# EasyEDA schematic Schematic.json
TITLE: Thiết kế hệ thống chống trộm sử dụng; REV: 1.0; Date: 2023-04-01; Sheet: 1/1; Company: CCE-SPKT
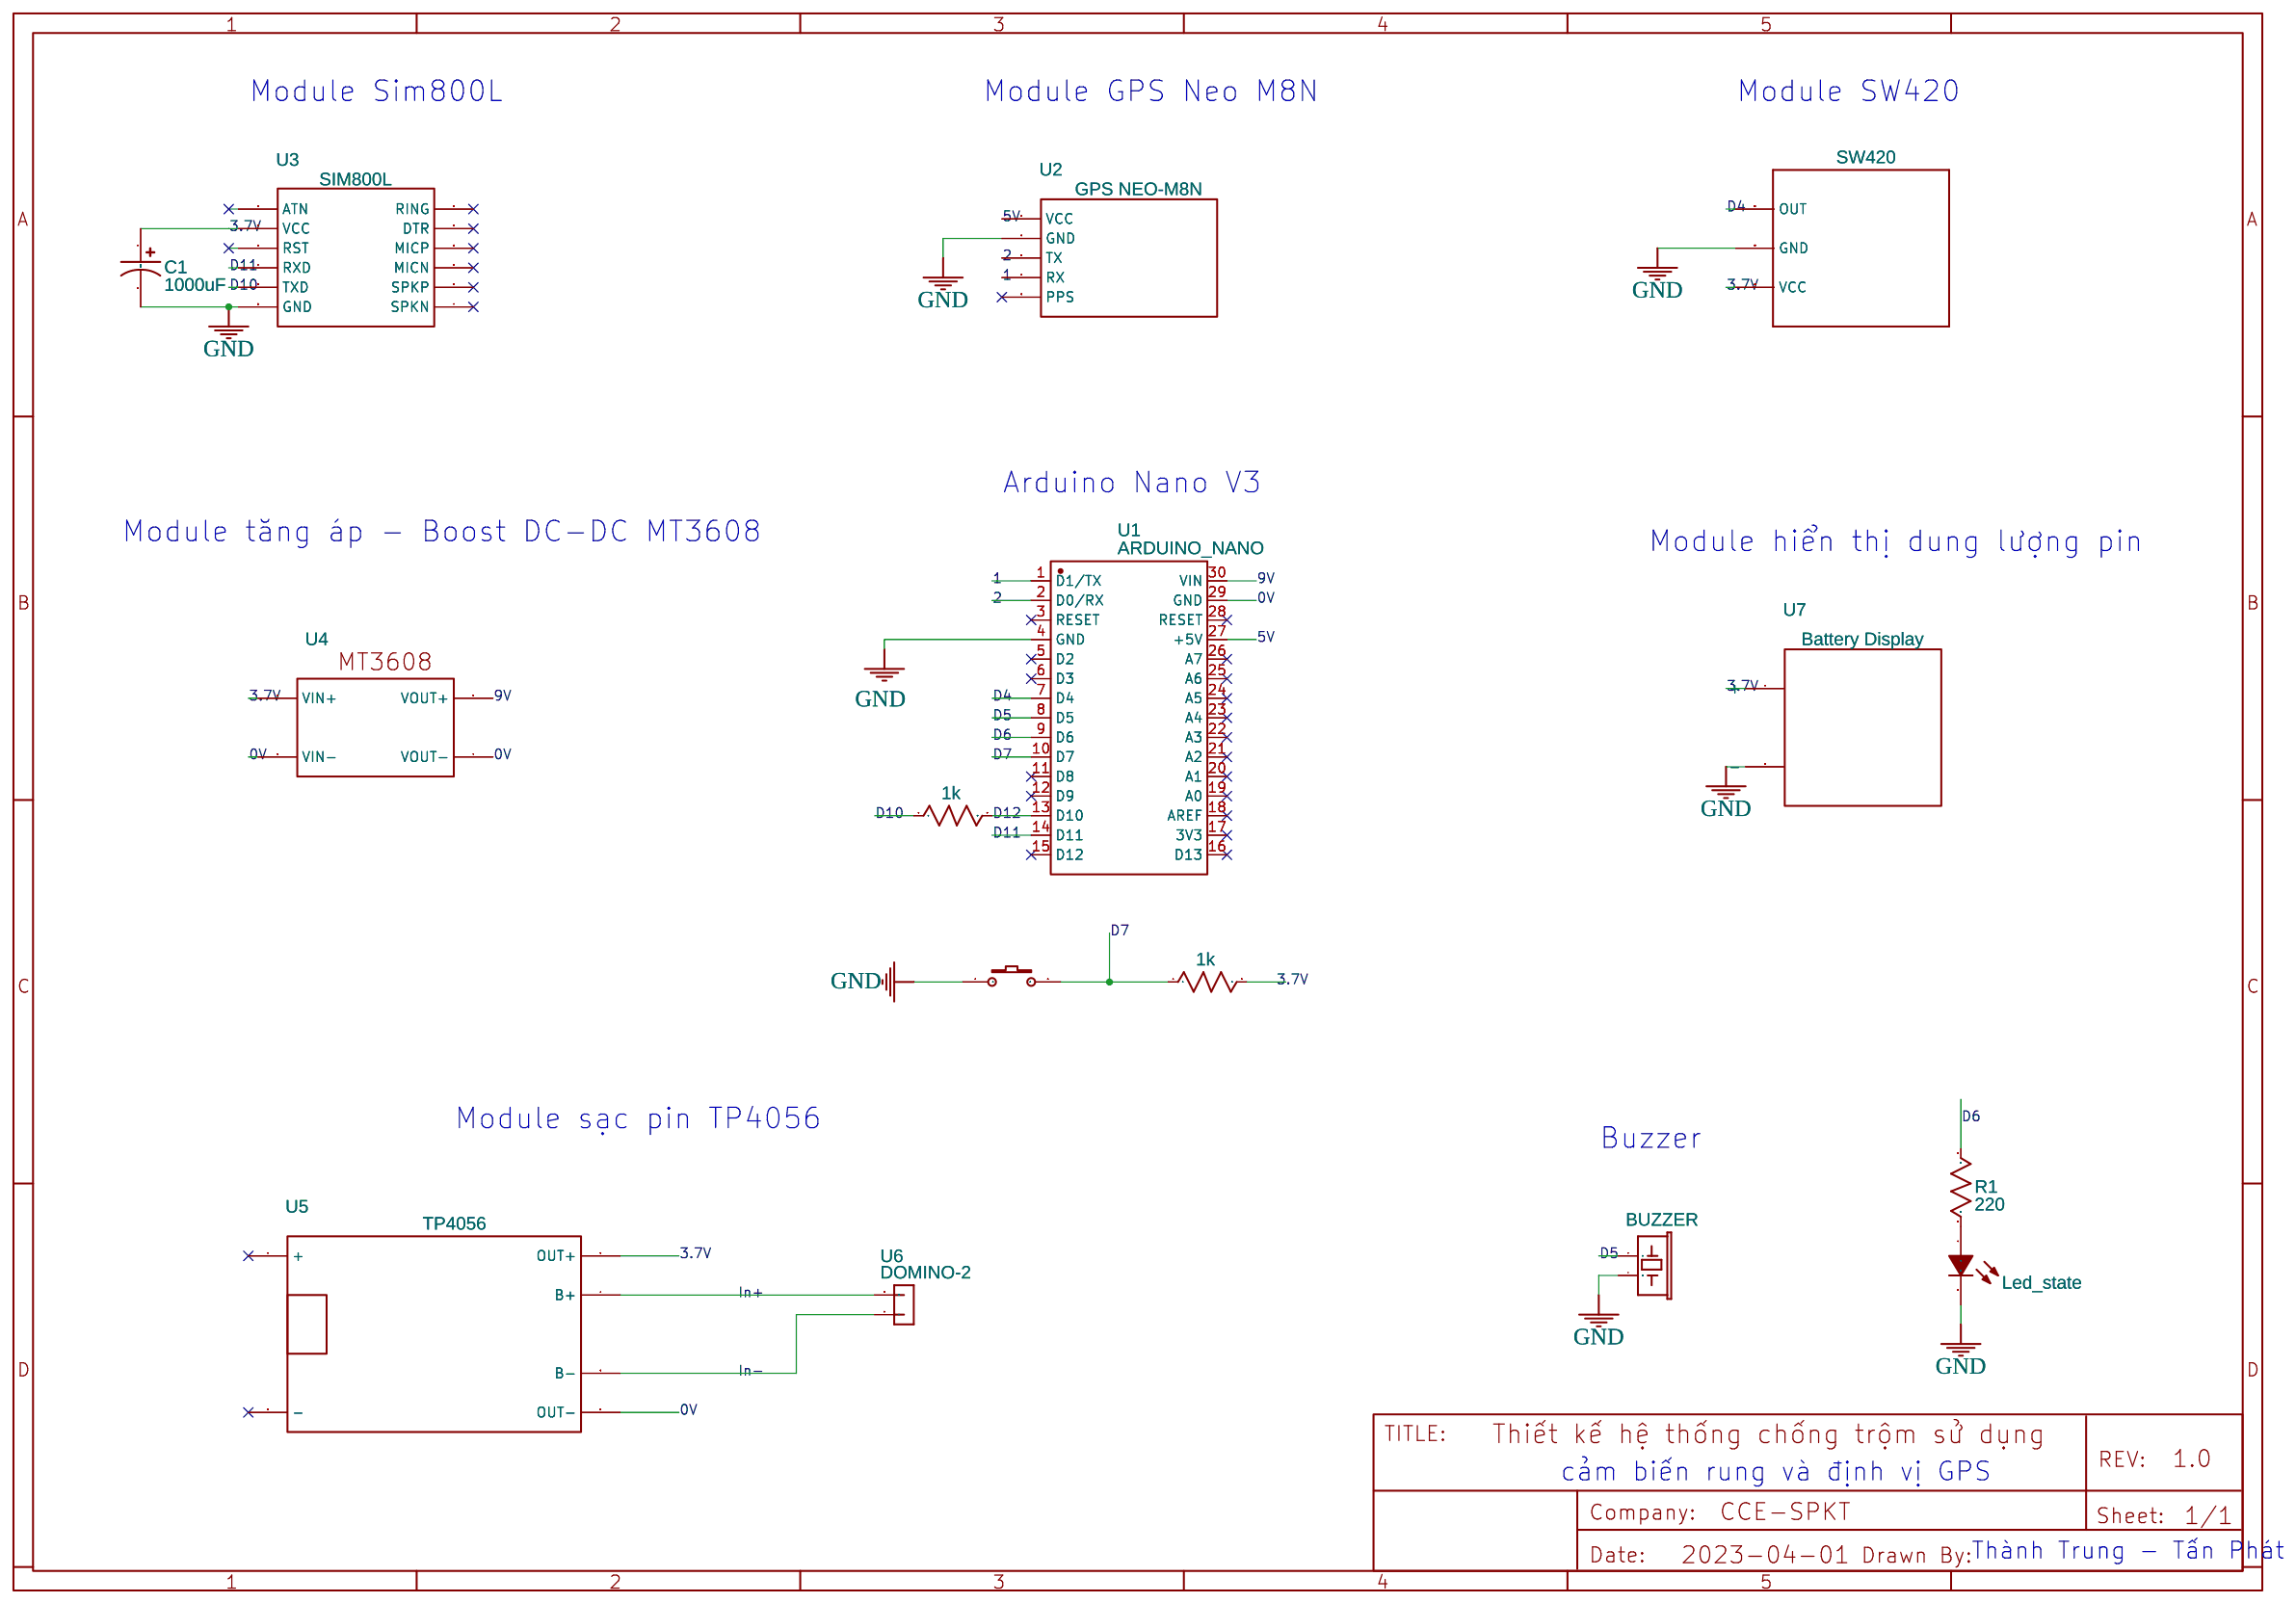
[diagram p0: schematic sheet]

## Parts
1  SW420  [SW420]
C1  1000uF  [CAP-TH_BD6.3-P2.50-D1.0-FD]
KEY1  K2-3.6×6.1_SMD  [TACT PUSH BUTTON MICRO SWITCH 6X6 4PIN]
LED1  Led_state  [LED-TH_BD5.0-P2.54-FD_C9900023552]
R1  220  [R0603]
R2  1k  [R0603]
R3  1k  [R0603]
SG1  BUZZER  [BUZZER-12MM-NS-KIT]
U1  ARDUINO_NANO  [COMM-TH_ARDUINO_NANO]
U2  GPS NEO-M8N  [NEO-M8N]
U3  SIM800L  [KICAD DOCUMENTS_LIBRARIES_SIM800.PRETTY_SIM800L]
U4  MT3608  [MT3608_M]
U5  TP4056  [TP4056 MODULE LITHIUM BATTERY CHARGING MODULE]
U6  DOMINO-2  [DOMINO-2]
U7  Battery Display  [PINHEADER-2PIN-2.50]

## Library data of the parts
1 = SW420: Contributor: Cacharritos
C1 = SHW1000UF6.3V6.3X11: Supplier: LCSC; Supplier Part: C494544; Manufacturer: KNSCHA(科尼盛); Contributor: LCSC; JLCPCB Part Class: Extended Part
KEY1 = K2-3.6×6.1_SMD: Supplier Part: C118141; Supplier: LCSC; Manufacturer Part: K2-1107ST-A4SW-06; Contributor: LCEDA_Lib; 制造商: 韩国韩荣
LED1 = LED_5MM: Supplier: LCSC; Supplier Part: C9900023552; Manufacturer: null; JLCPCB Part Class: Extended Part; Contributor: lcsc
R1-R3 = R_0603_US: Contributor: LCEDA_Lib
SG1 = BUZZERPTH-NS-KIT: Buzzer 12mm
U1 = ARDUINO_NANO: Supplier: LCSC; Supplier Part: C9900017879; Manufacturer: null; JLCPCB Part Class: Extended Part; Contributor: lcsc
U2 = NEO-M8N Double Sided GPS Mini Module: link: https://www.aliexpress.us/item/3256803012340580.html; Contributor: cdavidson0522
U3 = SIM800L_MODULE: Contributor: ahmadgolchin
U4 = MT3608: Contributor: vadimch
U5 = TP4056 MODULE: Contributor: jhon78
U6 = DOMINO-2
U7 = báo pin: Manufacturer Part: 540-563; Contributor: trung20119302; Supplier Part: 540-563; Supplier: GME; link: https://www.gme.cz/li-pol-akumulator-3-7v-400mah-4x30x35mm

## Nets
0V: U1.29(GND) U4.2(VIN-) U4.4(VOUT-) U5.6(OUT-)
3.7V: 1.VCC C1.1 R2.2 U3.2(VCC) U4.1(VIN+) U5.3(OUT+) U7.1(+)
5V: U1.27(+5V) U2.1(VCC)
9V: U1.30(VIN) U4.3(VOUT+)
GND: 1.GND C1.2 KEY1.1 LED1.2(K) SG1.-(2) U1.4(GND) U2.2(GND) U3.6(GND) U7.2(-)
1: U1.1(D1/TX) U2.4(RX)
2: U1.2(D0/RX) U2.3(TX)
D4: 1.OUT U1.7(D4)
D5: SG1.+(1) U1.8(D5)
D6: R1.1 U1.9(D6)
D7: KEY1.2 R2.1 U1.10(D7)
D10: R3.1 U3.5(TXD)
D11: U1.14(D11) U3.4(RXD)
D12: R3.2 U1.13(D10)
In+: U5.4(B+) U6.2
In-: U5.5(B-) U6.1
Net-(LED1-1): LED1.1(A) R1.2

Not connected (* = marked no-connect by the designer): U1 3(RESET)* 5(D2)* 6(D3)* 11(D8)* 12(D9)* 15(D12)* 16(D13)* 17(3V3)* 18(AREF)* 19(A0)* 20(A1)* 21(A2)* 22(A3)* 23(A4)* 24(A5)* 25(A6)* 26(A7)* 28(RESET)*; U2 5(PPS)*; U3 1(ATN) 3(RST) 7(SPKN)* 8(SPKP)* 9(MICN)* 10(MICP)* 11(DTR)* 12(RING)*; U5 1(+)* 2(-)*

## Notes on the sheet
- Module Sim800L
- Module GPS Neo M8N
- Module SW420
- Arduino Nano V3
- Module tăng áp - Boost DC-DC MT3608
- Module hiển thị dung lượng pin
- Module sạc pin TP4056
- Buzzer
- cảm biến rung và định vị GPS
- Thành Trung - Tấn Phát
